# Altium schematic sheet NAND.schdoc
size 401 x 103 mm
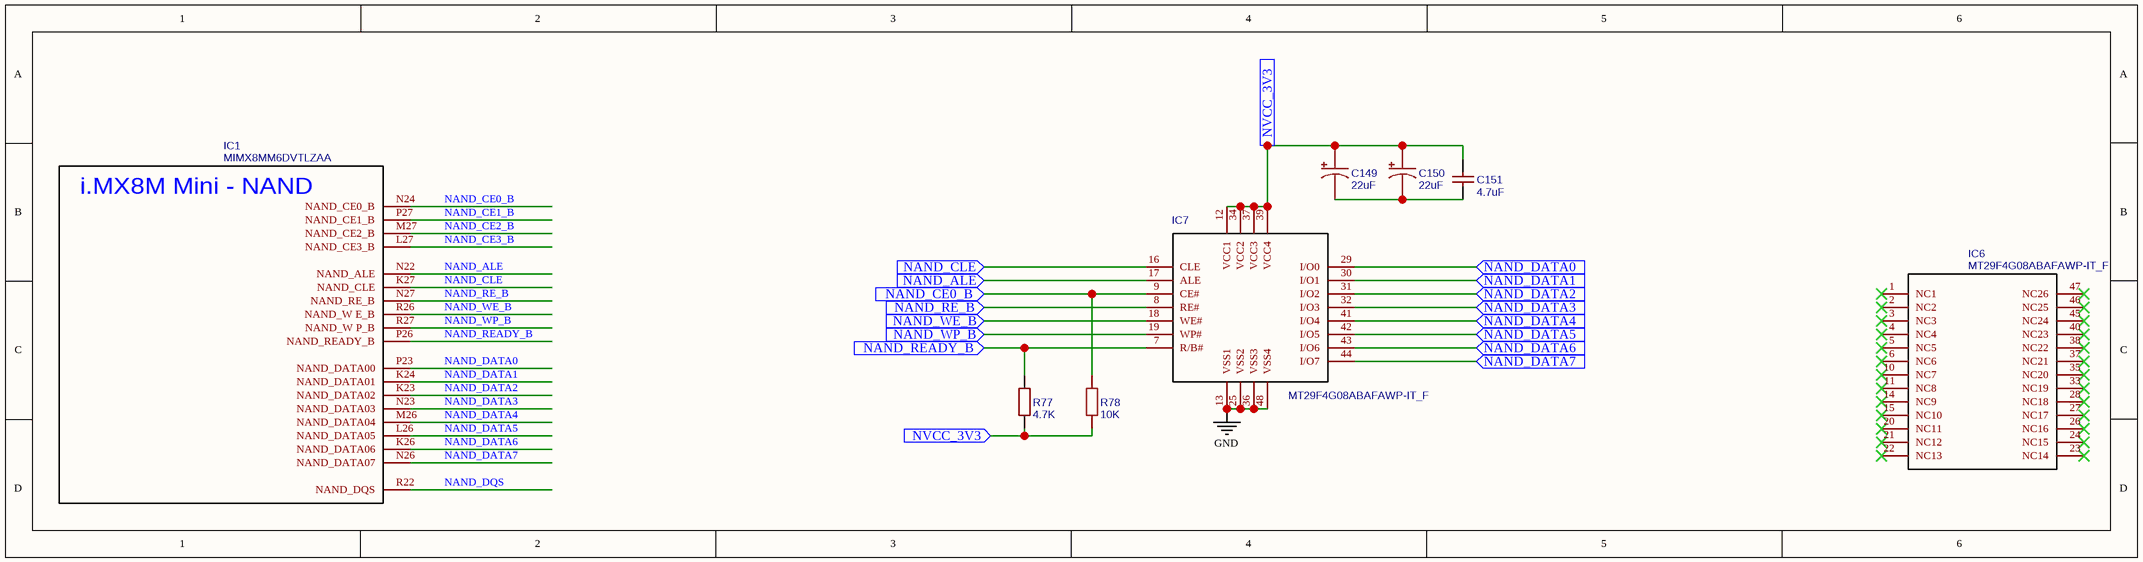
[diagram p0: NAND.schdoc]

## Parts
C149  22uF  [CAP-SMD_L3.2-W1.6-R-RD]
C150  22uF  [CAP-SMD_L3.2-W1.6-R-RD]
C151  4.7uF  [C0603]
IC1  MIMX8MM6DVTLZAA  [BGA486C50P27X27_1400X1400X125]
IC6  MT29F4G08ABAFAWP-IT_F  [SOP50P2000X120-48N]
IC7  MT29F4G08ABAFAWP-IT_F  [SOP50P2000X120-48N]
R77  4.7K  [R0402]
R78  10K  [R0402]

## Ports
NAND_ALE (in), NAND_CE0_B (in), NAND_CLE (in), NAND_DATA0 (in), NAND_DATA1 (in), NAND_DATA2 (in), NAND_DATA3 (in), NAND_DATA4 (in), NAND_DATA5 (in), NAND_DATA6 (in), NAND_DATA7 (in), NAND_RE_B (in), NAND_READY_B (in), NAND_WE_B (in), NAND_WP_B (in), NVCC_3V3 (in)

## Nets
GND: IC7.13(VSS1) IC7.25(VSS2) IC7.36(VSS3) IC7.48(VSS4)
NAND_ALE: IC1.N22(NAND_ALE)
NAND_ALE: IC7.17(ALE) ; port NAND_ALE  [a separate net that carries the same name]
NAND_CE0_B: IC1.N24(NAND_CE0_B)
NAND_CE0_B: IC7.9(CE#) R78.2 ; port NAND_CE0_B  [a separate net that carries the same name]
NAND_CE1_B: IC1.P27(NAND_CE1_B)
NAND_CE2_B: IC1.M27(NAND_CE2_B)
NAND_CE3_B: IC1.L27(NAND_CE3_B)
NAND_CLE: IC1.K27(NAND_CLE)
NAND_CLE: IC7.16(CLE) ; port NAND_CLE  [a separate net that carries the same name]
NAND_DATA0: IC1.P23(NAND_DATA00)
NAND_DATA0: IC7.29(I/O0) ; port NAND_DATA0  [a separate net that carries the same name]
NAND_DATA1: IC1.K24(NAND_DATA01)
NAND_DATA1: IC7.30(I/O1) ; port NAND_DATA1  [a separate net that carries the same name]
NAND_DATA2: IC1.K23(NAND_DATA02)
NAND_DATA2: IC7.31(I/O2) ; port NAND_DATA2  [a separate net that carries the same name]
NAND_DATA3: IC1.N23(NAND_DATA03)
NAND_DATA3: IC7.32(I/O3) ; port NAND_DATA3  [a separate net that carries the same name]
NAND_DATA4: IC1.M26(NAND_DATA04)
NAND_DATA4: IC7.41(I/O4) ; port NAND_DATA4  [a separate net that carries the same name]
NAND_DATA5: IC1.L26(NAND_DATA05)
NAND_DATA5: IC7.42(I/O5) ; port NAND_DATA5  [a separate net that carries the same name]
NAND_DATA6: IC1.K26(NAND_DATA06)
NAND_DATA6: IC7.43(I/O6) ; port NAND_DATA6  [a separate net that carries the same name]
NAND_DATA7: IC1.N26(NAND_DATA07)
NAND_DATA7: IC7.44(I/O7) ; port NAND_DATA7  [a separate net that carries the same name]
NAND_DQS: IC1.R22(NAND_DQS)
NAND_RE_B: IC1.N27(NAND_RE_B)
NAND_RE_B: IC7.8(RE#) ; port NAND_RE_B  [a separate net that carries the same name]
NAND_READY_B: IC1.P26(NAND_READY_B)
NAND_READY_B: IC7.7(R/B#) R77.2 ; port NAND_READY_B  [a separate net that carries the same name]
NAND_WE_B: IC1.R26(NAND_W_E_B)
NAND_WE_B: IC7.18(WE#) ; port NAND_WE_B  [a separate net that carries the same name]
NAND_WP_B: IC1.R27(NAND_W_P_B)
NAND_WP_B: IC7.19(WP#) ; port NAND_WP_B  [a separate net that carries the same name]
NVCC_3V3: C149.1 C150.1 C151.2 IC7.12(VCC1) IC7.34(VCC2) IC7.37(VCC3) IC7.39(VCC4) R77.1 R78.1 ; port NVCC_3V3
NetC149_2: C149.2 C150.2 C151.1

Not connected (* = marked no-connect by the designer): IC6 1(NC1)* 2(NC2)* 3(NC3)* 4(NC4)* 5(NC5)* 6(NC6)* 10(NC7)* 11(NC8)* 14(NC9)* 15(NC10)* 20(NC11)* 21(NC12)* 22(NC13)* 23(NC14)* 24(NC15)* 26(NC16)* 27(NC17)* 28(NC18)* 33(NC19)* 35(NC20)* 37(NC21)* 38(NC22)* 40(NC23)* 45(NC24)* 46(NC25)* 47(NC26)*

## Notes on the sheet
- (in symbol MIMX8MM6DVTLZAA) i.MX8M Mini - NAND

## Library data of the parts
C149 C150 = 22uF: BOM_Manufacturer: Shenzhen Zhenhua XinYun Elec; BOM_Manufacturer Part: CA45B-A-10V-22uF-K; nameAlias: Capacitance; Contributor: LCSC; SMT Type: Extend; BOM_Supplier: LCSC; BOM_Supplier Part: C141305; BOM_JLCPCB SMD: Yes; spicePre: C; spiceSymbolName: CA45B-A-10V-22UF-K
C151 = 4.7uF: BOM_Manufacturer Part: CL10A475KP8NNNC; BOM_Manufacturer: SAMSUNG; nameAlias: Capacitance; SMT Type: Extend; BOM_Supplier: LCSC; BOM_Supplier Part: C1705; BOM_JLCPCB SMD: Yes; spicePre: C; spiceSymbolName: CL10A475KP8NNNC
IC1 = MIMX8MM6DVTLZAA: subpart_no: 2; Contributor: Ke'Ondrae_Mell; spicePre: I; spiceSymbolName: MIMX8MM6DVTLZAA
IC6 = MT29F4G08ABAFAWP-IT_F: subpart_no: 2; Contributor: Ke'Ondrae_Mell; spicePre: I; spiceSymbolName: MT29F4G08ABAFAWP-IT_F
IC7 = MT29F4G08ABAFAWP-IT_F: subpart_no: 1; Contributor: Ke'Ondrae_Mell; spicePre: I; spiceSymbolName: MT29F4G08ABAFAWP-IT_F
R77 = 4.7K: BOM_Manufacturer: UniOhm; BOM_Manufacturer Part: 0402WGF4701TCE; nameAlias: Resistance (Ohms); SMT Type: Basic; BOM_Supplier: LCSC; BOM_Supplier Part: C25900; BOM_JLCPCB SMD: Yes; spicePre: R; spiceSymbolName: 0402WGF4701TCE
R78 = 10K: BOM_Manufacturer: Uniroyal Elec; BOM_Manufacturer Part: NQ02WGF1002TCE; nameAlias: Resistance (Ohms); Contributor: LCSC; SMT Type: Extend; BOM_Supplier: LCSC; BOM_Supplier Part: C270381; BOM_JLCPCB SMD: Yes; spicePre: R; spiceSymbolName: NQ02WGF1002TCE